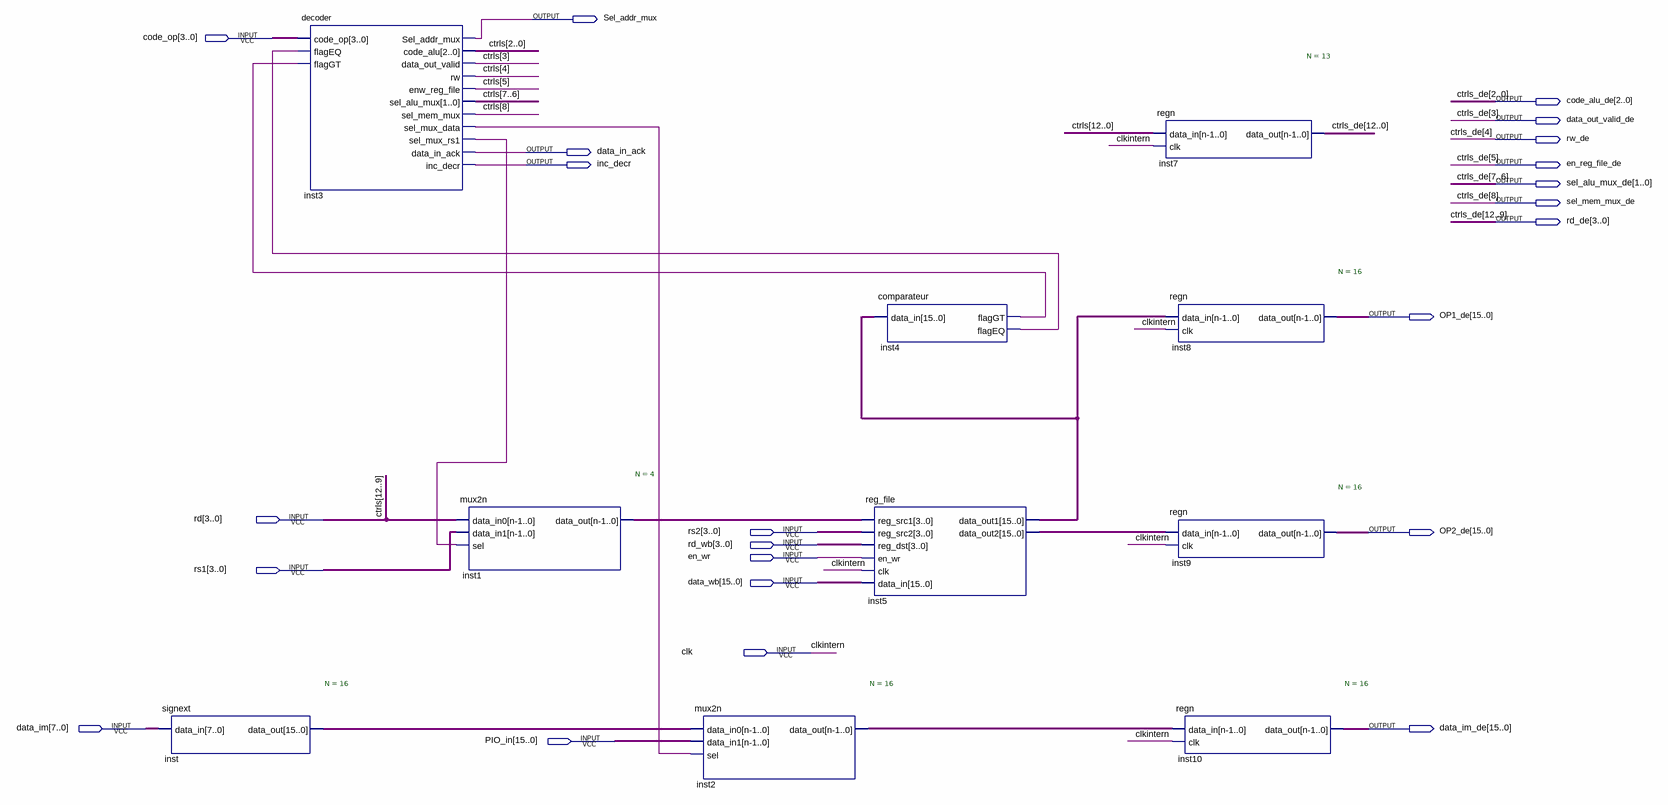
[diagram p0: schematic sheet]
// Quartus schematic decstage.bdf as structural Verilog: 10 symbols, 23 pins
module decstage (
  input  [3:0] code_op,
  input  [3:0] rd,
  input  [3:0] rs2,
  input  [3:0] rd_wb,
  input  en_wr,
  input  [3:0] rs1,
  input  [15:0] data_wb,
  input  clk,
  input  [7:0] data_im,
  input  [15:0] PIO_in,
  output Sel_addr_mux,
  output [2:0] code_alu_de,
  output data_out_valid_de,
  output rw_de,
  output data_in_ack,
  output inc_decr,
  output en_reg_file_de,
  output [1:0] sel_alu_mux_de,
  output sel_mem_mux_de,
  output [3:0] rd_de,
  output [15:0] OP1_de,
  output [15:0] OP2_de,
  output [15:0] data_im_de
);

  wire inst3_sel_mux_data, inst3_sel_mux_rs1, inst4_flageq, inst4_flaggt;
  wire [3:0] inst1_data_out;
  wire [8:0] ctrls;
  wire [15:0] inst2_data_out, inst5_data_out1, inst5_data_out2, inst_data_out;

  signext #(.N(16)) inst (.data_in(data_im), .data_out(inst_data_out));
  decoder inst3 (
    .code_op(code_op), .flagEQ(inst4_flageq), .flagGT(inst4_flaggt), .Sel_addr_mux(Sel_addr_mux),
    .code_alu(ctrls[2:0]), .data_out_valid(ctrls[3]), .rw(ctrls[4]), .enw_reg_file(ctrls[5]),
    .sel_alu_mux(ctrls[7:6]), .sel_mem_mux(ctrls[8]), .sel_mux_data(inst3_sel_mux_data),
    .sel_mux_rs1(inst3_sel_mux_rs1), .data_in_ack(data_in_ack), .inc_decr(inc_decr));
  mux2n #(.N(4)) inst1 (.data_in0(rd), .data_in1(rs1), .sel(inst3_sel_mux_rs1), .data_out(inst1_data_out));
  mux2n #(.N(16)) inst2 (
    .data_in0(inst_data_out), .data_in1(PIO_in), .sel(inst3_sel_mux_data), .data_out(inst2_data_out));
  comparateur inst4 (.data_in(inst5_data_out1), .flagGT(inst4_flaggt), .flagEQ(inst4_flageq));
  reg_file inst5 (
    .reg_src1(inst1_data_out), .reg_src2(rs2), .reg_dst(rd_wb), .en_wr(en_wr), .clk(clk), .data_in(data_wb),
    .data_out1(inst5_data_out1), .data_out2(inst5_data_out2));
  regn #(.N(13)) inst7 (
    .data_in({rd, ctrls}), .clk(clk),
    .data_out({rd_de, sel_mem_mux_de, sel_alu_mux_de, en_reg_file_de, rw_de, data_out_valid_de, code_alu_de}));
  regn #(.N(16)) inst8 (.data_in(inst5_data_out1), .clk(clk), .data_out(OP1_de));
  regn #(.N(16)) inst9 (.data_in(inst5_data_out2), .clk(clk), .data_out(OP2_de));
  regn #(.N(16)) inst10 (.data_in(inst2_data_out), .clk(clk), .data_out(data_im_de));

  // Other names for the same wires on the sheet: clkintern = clk;
  //   ctrls_de[12:0] = {rd_de, sel_mem_mux_de, sel_alu_mux_de, en_reg_file_de, rw_de, data_out_valid_de, code_alu_de};
  //   ctrls[12:9] = rd
endmodule
